# Altium schematic sheet airu-board_1.SchDoc
size 296 x 230 mm
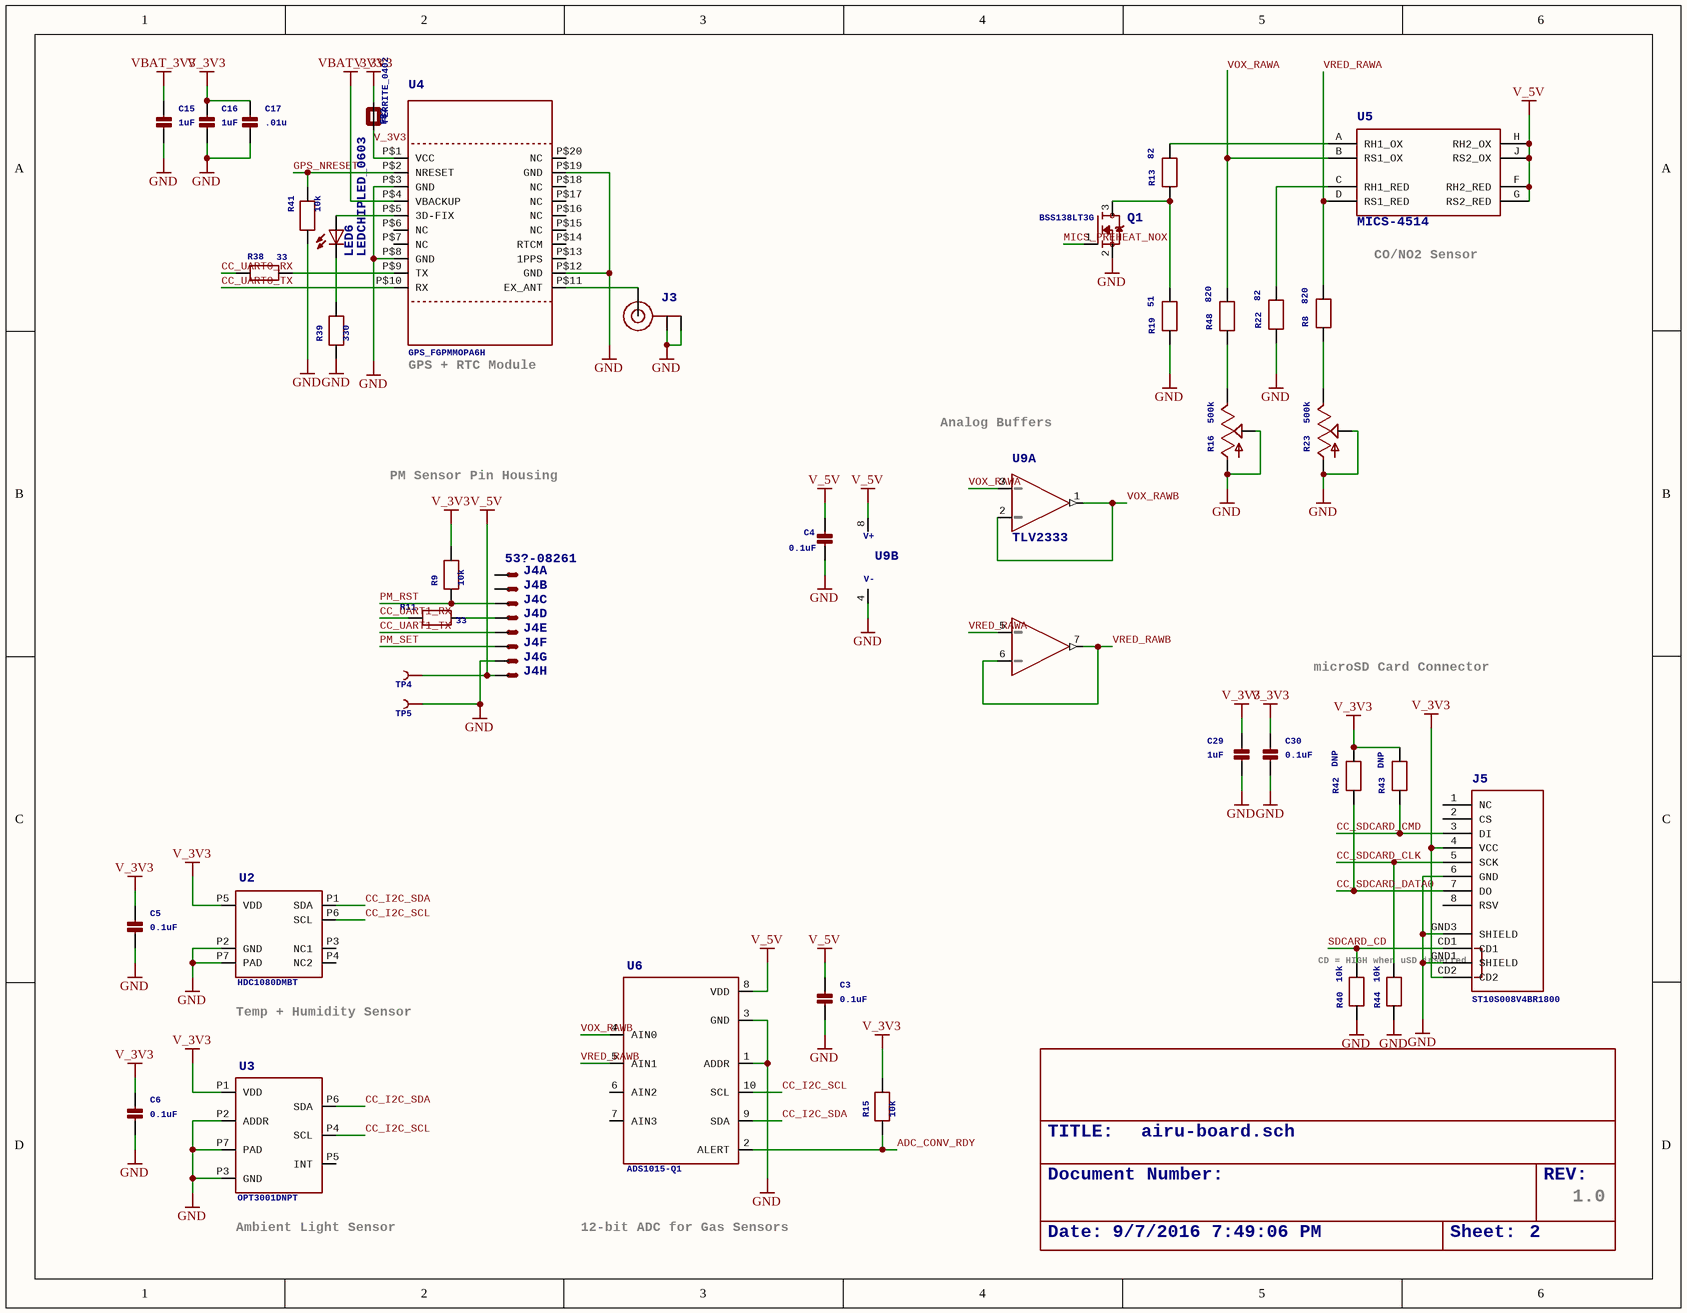
[diagram p0: airu-board_1.SchDoc]

## Parts
C3  0.1uF  [_0402]
C4  0.1uF  [_0402]
C5  0.1uF  [_0402]
C6  0.1uF  [_0402]
C15  1uF  [_0402]
C16  1uF  [_0402]
C17  .01u  [_0402]
C29  1uF  [_0402]
C30  0.1uF  [_0402]
FB2  FERRITE_0402  [_0402]
FRAME3  FRAME_A_L  (value not drawn)  (parts A,B of 2)
J3  U.FL-R-SMT-1(10)  [U.FL]  (value not drawn)
J4  53?-08261  [53261-08]  (parts A,B,C,D,E,F,G,H of 8)
J5  ST10S008V4BR1800  [MICROSD_1:1]
LED6  LEDCHIPLED_0603  [CHIPLED_0603]
Q1  BSS138LT3G  [SOT23]
R8  820  [0402]
R9  10k  [0402]
R11  33  [0402]
R13  82  [0402]
R15  10k  [0402]
R16  500k  [B25P]
R19  51  [0402]
R22  82  [0402]
R23  500k  [B25P]
R38  33  [0402]
R39  330  [0402]
R40  10k  [0402]
R41  10k  [0402]
R42  DNP  [0402]
R43  DNP  [0402]
R44  10k  [0402]
R48  820  [0402]
TP4  TEST-POINT2  [PAD.02X.02]  (value not drawn)
TP5  TEST-POINT2  [PAD.02X.02]  (value not drawn)
U2  HDC1080DMBT  [WSON]
U3  OPT3001DNPT  [USON]
U4  GPS_FGPMMOPA6H  [FGPMMOPA6H]
U5  MICS-4514  [MICS_10-SMD]
U6  ADS1015-Q1  [S-PDSO-G10]
U9  TLV2333  [DGK_S-PDSO-G8]  (parts A,B of 2)

## Nets
GND: C3.2(P$2) C4.2(P$2) C5.2(P$2) C6.2(P$2) C15.2(P$2) C16.2(P$2) C17.2(P$2) C29.2(P$2) C30.2(P$2) J3.1(GND) J3.2(GND) J4.7(S) J5.6(GND) J5.GND1(SHIELD) J5.GND3(SHIELD) Q1.2(S) R16.A R16.S R19.1 R22.1 R23.A R23.S R39.1 R40.1 R41.1 R44.1 TP5.P$1 U2.P2(GND) U2.P7(PAD) U3.P2(ADDR) U3.P3(GND) U3.P7(PAD) U4.P$3(GND) U4.P$8(GND) U4.P$12(GND) U4.P$19(GND) U6.1(ADDR) U6.3(GND) U9.4(V-)
V_3V3: C5.1(P$1) C6.1(P$1) C16.1(P$1) C17.1(P$1) C29.1(P$1) C30.1(P$1) FB2.1(P$1) FB2.2(P$2) J5.4(VCC) J5.CD2 R9.2 R15.2 R42.2 R43.2 U2.P5(VDD) U3.P1(VDD) U4.P$1(VCC)
V_5V: C3.1(P$1) C4.1(P$1) J4.8(S) TP4.P$1 U5.F(RH2_RED) U5.G(RS2_RED) U5.H(RH2_OX) U5.J(RS2_OX) U6.8(VDD) U9.8(V+)
VBAT_3V3: C15.1(P$1) U4.P$4(VBACKUP)
ADC_CONV_RDY: R15.1 U6.2(ALERT)
CC_I2C_SCL: U2.P6(SCL) U3.P4(SCL) U6.10(SCL)
CC_I2C_SDA: U2.P1(SDA) U3.P6(SDA) U6.9(SDA)
CC_SDCARD_CLK: J5.5(SCK) R44.2
CC_SDCARD_CMD: J5.3(DI) R43.1
CC_SDCARD_DATA0: J5.7(DO) R42.1
CC_UART0_RX: R38.1
CC_UART0_TX: U4.P$10(RX)
CC_UART1_RX: R11.1
CC_UART1_TX: J4.5(S)
GPS_NRESET: R41.2 U4.P$2(NRESET)
MICS_PREHEAT_NOX: Q1.1(G)
PM_RST: J4.3(S) R9.1
PM_SET: J4.6(S)
SDCARD_CD: J5.CD1 R40.2
VOX_RAWA: R48.2 U5.B(RS1_OX) U9.3(+)
VOX_RAWB: U6.4(AIN0) U9.1(OUT) U9.2(-)
VRED_RAWA: R8.2 U5.D(RS1_RED) U9.5(+1)
VRED_RAWB: U6.5(AIN1) U9.6(-1) U9.7(OUT1)
NetJ3_3: J3.3(SIGNAL) U4.P$11(EX_ANT)
NetJ4_4: J4.4(S) R11.2
NetLED6_A: LED6.A U4.P$5(3D-FIX)
NetLED6_C: LED6.C R39.2
NetQ1_3: Q1.3(D) R13.1 R19.2
NetR8_1: R8.1 R23.E
NetR13_2: R13.2 U5.A(RH1_OX)
NetR16_E: R16.E R48.1
NetR22_2: R22.2 U5.C(RH1_RED)
NetR38_2: R38.2 U4.P$9(TX)

Not connected (* = marked no-connect by the designer): J4 1(S) 2(S); J5 1(NC) 2(CS) 8(RSV); U2 P3(NC1) P4(NC2); U3 P5(INT); U4 P$6(NC) P$7(NC) P$13(1PPS) P$14(RTCM) P$15(NC) P$16(NC) P$17(NC) P$18(NC) P$20(NC); U6 6(AIN2) 7(AIN3)

## Notes on the sheet
- CO/NO2 Sensor
- GPS + RTC Module
- Analog Buffers
- PM Sensor Pin Housing
- microSD Card Connector
- CD = HIGH when uSD inserted.
- (near U2) Temp + Humidity Sensor
- (near U3) Ambient Light Sensor
- 12-bit ADC for Gas Sensors
- 1.0

## Library data of the parts
C3-C6 C15-C17 C29 C30 = CAP_CERAMIC_0402: <p><b>Ceramic Capacitors</b></p> / <b>0402</b> - 0402 Surface Mount Capacitors / <ul> / <li>16pF 50V 5% [Digikey: 445-4899-2-ND]</li> / <li>18pF 50V 5% [Digikey: 490-1281-2-ND]</li> / <li>22pF 50V 5% [Digikey: 490-1283-2-ND]</li> / <li>68pF 50V 5% [Digikey: 490-1289-2-ND]</li> / <li>0.1uF 10V 10% [Digikey: 490-1318-2-ND]</li> / <li>1.0uF 6.3V 10% [Digikey: 490-1320-2-ND]</li> / </ul> / <b>0603</b> - 0603 Surface Mount Capacitors / <ul> / <li>16 pF 50V 5% [Digikey: 445-5051-2-ND]</li> / <li>22 pF 50V [Digikey: PCC220ACVTR-ND]</li> / <li>33 pF 50V 5% [Digikey: 490-1415-1-ND]</li> / <li>56pF 50V 5% [Digikey: 490-1421-1-ND]</li> / <li>220pF 50V 5% [Digikey: 445-1285-1-ND]</li> / <li>680 pF 50V </li> / <li>2200 pF 50V 5% C0G [Digikey: 445-1297-1-ND]</li> / <li>5600 pF 100V 5% X7R [Digikey: 478-3711-1-ND]</li> / <li>0.1 µF 25V 10% [Digikey: PCC2277TR-ND]</li> / <li>0.22 µF 16V 10% X7R [Digikey: 445-1318-1-ND]</li> / <li>1.0 µF 25V 10% [Digikey: 445-5146-2-ND]</li> / </ul> / <b>0603</b> - RF Specific / <ul> / <li>3pF 250V +/-0.1pF RF [Digikey: 712-1347-1-ND]</li> / <li>18 pF 250V 5%  [Digikey: 478-3505-1-ND or 712-1322-1-ND]</li> / <li>56 pF 250V 5% C0G RF [Digikey: 490-4867-1-ND]</li> / <li>68 pF 250V RF [Digikey: 490-4868-1-ND]</li> / </ul> / <b>0805</b> - 0805 Surface Mount Capacitors / <ul> / <li>220 pF 250V 2% <strong>RF</strong> Ceramic Capacitor [Digikey: 712-1398-1-ND]</li> / <li>1000 pF 50V 2% NP0 Ceramic Capacitor [Digikey: 478-3760-1-ND]</li> / <li>0.1 µF 25V 10% Ceramic Capacitor [Digikey: PCC1828TR-ND]</li> / <li>1.0 µF 16V 10% Ceramic Capacitor[Digikey: 490-1691-2-ND]</li> / <li>10.0 µF 10V 10% Ceramic Capacitor[Digikey: 709-1228-1-ND]</li> / <li>10.0 uF 16V 10% Ceramic Capacitor [Digikey: 478-5165-2-ND]</li> / <li>47 uF 6.3V 20% Ceramic Capacitor [Digikey: 587-1779-1-ND or 399-5506-1-ND]</li> / </ul> / </ul><b>1206</b> - 1206 Surface Mount Capacitors / <ul> / <li>47uF 10V 20% Ceramic Capacitor [Digikey: 490-5528-1-ND or 399-5508-1-ND or 445-6010-1-ND]</li> / <li>100uF 6.3V -20%, +80% Y5V Ceramic Capacitor (Digikey: 490-4512-1-ND, Mouser: 81-GRM31CF50J107ZE1L)</li> / </ul>
FB2 = FERRITE_0402: <p><b>Ferrite Bead</b></p> / <p>0603</p> / <ul> / <li>MMZ1608B121C - 120 Ohm @ 100MHz, 600mA, 0.15 Ohm DC Resistance - Digikey: 445-2164-1-ND</li> / <li>BK1608HW121-T - 120 Ohm, 600mA Ferrite Chip - Digikey: 587-1876-2-ND</li> / </ul> / <p>0805</p> / <ul> / <li>HZ0805B272R-10 - 2.7K Ohm @ 100MHz, 200mA, 0.8 Ohm DC Resistance - Digikey: 240-2504-1-ND (see also Murata BLM21BD272SN1L)</li> / <li>MMZ2012Y152B - 1.5K Ohm @ 100MHz, 500mA, 0.4 Ohm DC Resistance - Digikey: 445-1560-1-ND - Mainly for high frequency (80-400MHz)</li> / <li>MMZ2012R102A - 1K Ohm @ 100MHz, 500mA, 0.3 Ohm DC Resistance - Digikey: 445-1555-2-ND - More general purpose (10-200MHz)</li> / </ul>
FRAME3 = FRAME_A_L: <b>FRAME</b> A Size , 8 1/2 x 11 INCH, Landscape<p>
J3 = U.FL: <p>U.FL Antenna Connector</p>
J4 = 53?-08261: <b>CONNECTOR</b><p> / wire to board 1.25 mm (.049 inch) pitch header; OC_FARNELL: 1125376; OC_NEWARK: unknown
J5 = USD-SOCKET: <b>microSD Socket</b> / Push-push type uSD socket. Schematic element and footprint production proven. Spark Fun Electronics SKU : PRT-00127. tDoc lines correctly indicate media card edge positions when inserting (unlocked, locked, depressed). / NOTE: CD1 and CD2 are connected internally
LED6 = LEDCHIPLED_0603: <b>LED</b><p> / <u>OSRAM</u>:<br> / - <u>CHIPLED</u><br> / LG R971, LG N971, LY N971, LG Q971, LY Q971, LO R971, LY R971 / LH N974, LH R974<br> / LS Q976, LO Q976, LY Q976<br> / LO Q996<br> / - <u>Hyper CHIPLED</u><br> / LW Q18S<br> / LB Q993, LB Q99A, LB R99A<br> / - <u>SideLED</u><br> / LS A670, LO A670, LY A670, LG A670, LP A670<br> / LB A673, LV A673, LT A673, LW A673<br> / LH A674<br> / LY A675<br> / LS A676, LA A676, LO A676, LY A676, LW A676<br> / LS A679, LY A679, LG A679<br> / -  <u>Hyper Micro SIDELED®</u><br> / LS Y876, LA Y876, LO Y876, LY Y876<br> / LT Y87S<br> / - <u>SmartLED</u><br> / LW L88C, LW L88S<br> / LB L89C, LB L89S, LG L890<br> / LS L89K, LO L89K, LY L89K<br> / LS L896, LA L896, LO L896, LY L896<br> / - <u>TOPLED</u><br> / LS T670, LO T670, LY T670, LG T670, LP T670<br> / LSG T670, LSP T670, LSY T670, LOP T670, LYG T670<br> / LG T671, LOG T671, LSG T671<br> / LB T673, LV T673, LT T673, LW T673<br> / LH T674<br> / LS T676, LA T676, LO T676, LY T676, LB T676, LH T676, LSB T676, LW T676<br> / LB T67C, LV T67C, LT T67C, LS T67K, LO T67K, LY T67K, LW E67C<br> / LS E67B, LA E67B, LO E67B, LY E67B, LB E67C, LV E67C, LT E67C<br> / LW T67C<br> / LS T679, LY T679, LG T679<br> / LS T770, LO T770, LY T770, LG T770, LP T770<br> / LB T773, LV T773, LT T773, LW T773<br> / LH T774<br> / LS E675, LA E675, LY E675, LS T675<br> / LS T776, LA T776, LO T776, LY T776, LB T776<br> / LHGB T686<br> / LT T68C, LB T68C<br> / - <u>Hyper Mini TOPLED®</u><br> / LB M676<br> / - <u>Mini TOPLED Santana®</u><br> / LG M470<br> / LS M47K, LO M47K, LY M47K / <p> / Source: http://www.osram.convergy.de<p> / <u>LUXEON:</u><br> / - <u>LUMILED®</u><br> / LXK2-PW12-R00, LXK2-PW12-S00, LXK2-PW14-U00, LXK2-PW14-V00<br> / LXK2-PM12-R00, LXK2-PM12-S00, LXK2-PM14-U00<br> / LXK2-PE12-Q00, LXK2-PE12-R00, LXK2-PE12-S00, LXK2-PE14-T00, LXK2-PE14-U00<br> / LXK2-PB12-K00, LXK2-PB12-L00, LXK2-PB12-M00, LXK2-PB14-N00, LXK2-PB14-P00, LXK2-PB14-Q00<br> / LXK2-PR12-L00, LXK2-PR12-M00, LXK2-PR14-Q00, LXK2-PR14-R00<br> / LXK2-PD12-Q00, LXK2-PD12-R00, LXK2-PD12-S00<br> / LXK2-PH12-R00, LXK2-PH12-S00<br> / LXK2-PL12-P00, LXK2-PL12-Q00, LXK2-PL12-R00 / <p> / Source: www.luxeon.com<p> / <u>KINGBRIGHT:</U><p> / KA-3528ASYC<br> / Source: www.kingbright.com
Q1 = MOSFET-NREFLOW: <b>N-Channel Mosfet</b> / <ul> / <li>2N7002E - 60V 260mA SOT23 [Digikey: 2N7002ET1GOSTR-ND] - <b>REEL</b></li> / <li>BSH103 - 30V 850mA SOT23 [Digikey: 568-5013-1-ND]</li> / </ul>
R8 R9 R11 R13 R15 R19 R22 R38-R44 R48 = RESISTOR0402: <p><b>Resistors</b></p> / <b>0402</b> - 0402 Surface Mount Package / <ul> / <li>22 Ohm 1% 1/16W [Digikey: 311-22.0LRTR-ND]</li> / <li>33 Ohm 5% 1/16W</li> / <li>1.0K 5% 1/16W</li> / <li>1.5K 5% 1/16W</li> / <li>2.0K 1% 1/16W</li> / <li>10.0K 1% 1/16W [Digikey: 311-10.0KLRTR-ND]</li> / <li>10.0K 5% 1/16W [Digikey: RMCF0402JT10K0TR-ND]</li> / <li>12.1K 1% 1/16W [Digikey: 311-22.0LRTR-ND]</li> / <li>100.0K 5% 1/16W</li> / </ul> / <b>0603</b> - 0603 Surface Mount Package<br> / <ul> / <li>0 Ohm 1/10 Watt 1% Resistor</li> / <li>15 Ohm 1/10 Watt 1% Resistor</li> / <li>33 Ohm 1/10 Watt 1% Resistor</li> / <li>49.9 Ohm 1/10 Watt 1% Resistor</li> / <li>100 Ohm 1/10 Watt 1% Resistor</li> / <li>150 Ohm 1/10 Watt 1% Resistor</li> / <li>240 Ohm 1/10 Watt 1% Resistor</li> / <li>390 Ohm 1/10 Watt 1% Resistor</li> / <li>560 Ohm 1/10 Watt 1% Resistor</li> / <li>680 Ohm 1/10 Watt 1% Resistor</li> / <li>750 Ohm 1/10 Watt 1% Resistor</li> / <li>1.0K Ohm 1/10 Watt 1% Resistor</li> / <li>1.5K Ohm 1/10 Watt 1% Resistor</li> / <li>2.0K Ohm 1/10 Watt 1% Resistor</li> / <li>2.2K Ohm 1/10 Watt 1% Resistor</li> / <li>3.3K Ohm 1/10 Watt 1% Resistor</li> / <li>4.7K Ohm 1/10 Watt 1% Resistor</li> / <li>10.0K Ohm 1/10 Watt 1% Resistor</li> / <li>12.0K Ohm 1/10 Watt 1% Resistor</li> / <li>12.1K Ohm 1/10 Watt 1% Resistor</li> / <li>20.0K Ohm 1/10 Watt 1% Resistor</li> / <li>33.0K Ohm 1/10 Watt 1% Resistor</li> / <li>100.0K Ohm 1/10 Watt 1% Resistor</li> / </ul> / <b>0805</b> - 0805 Surface Mount Package / <ul> / <li>0 Ohm 1/8 Watt 1% Resistor</li> / <li>33 Ohm 1/8 Watt 1% Resistor</li> / <li>100 Ohm 1/8 Watt 1% Resistor</li> / <li>150 Ohm 1/8 Watt 1% Resistor</li> / <li>200 Ohm 1/8 Watt 1% Resistor</li> / <li>240 Ohm 1/8 Watt 1% Resistor</li> / <li>330 Ohm 1/8 Watt 1% Resistor</li> / <li>390 Ohm 1/8 Watt 1% Resistor</li> / <li>470 Ohm 1/8 Watt 1% Resistor</li> / <li>1.0K Ohm 1/8 Watt 1% Resistor</li> / <li>1.5K Ohm 1/8 Watt 1% Resistor</li> / <li>2.0K Ohm 1/8 Watt 1% Resistor</li> / <li>4.7K Ohm 1/8 Watt 1% Resistor</li> / <li>5.1K Ohm 1/8 Watt 1% Resistor</li> / <li>5.6K Ohm 1/8 Watt 1% Resistor</li> / <li>10.0K Ohm 1/8 Watt 1% Resistor</li> / <li>22.0K Ohm 1/8 Watt 1% Resistor</li> / <li>33.0K Ohm 1/8 Watt 1% Resistor</li> / <li>100K Ohm 1/8 Watt 1% Resistor</li> / </ul> / <b>1206</b> - 1206 Surface Mount Package<br/> / <br/> / <b>2012</b> - 2010 Surface Mount Package<br/> / <ul><li>0.11 Ohm 1/2 Watt 1% Resistor - Digikey: RHM.11UCT-ND</li></ul>
R16 R23 = TRIM_US-B25P: <b>POTENTIOMETER</b>
TP4 TP5 = TEST-POINT2: Bare copper test points for troubleshooting or ICT
U2 = HDC1080: The HDC1080 is a low power digital humidity sensor with integrated temperature sensor with excellent measurement accuracy . It operates over a wide supply range, and is a low cost, low power alternative to competitive solutions in a wide range of common applications. The humidity and temperature sensors are factory calibrated.
U3 = OPT3001: The OPT3001 is a single-chip lux meter, measuring the intensity of light as visible by the human eye.
U4 = GPS_FGPMMOPA6H: <b>GPS Module</b> - MTK MT3339 Chipset, -165dBm sensitivity, 22 channels, 10Hz, auto-select external antenna options
U5 = MICS-4514: Metal oxide MEMS carbon monoxide (CO) and NOx sensor in an SMD package.
U6 = ADS1015